# Altium schematic sheet MOTHERBOARD.SCHDOC
size 999 x 800 mm; SheetNumber: 1; SheetTotal: 1; DocumentName: Лист 1.SCHDOC
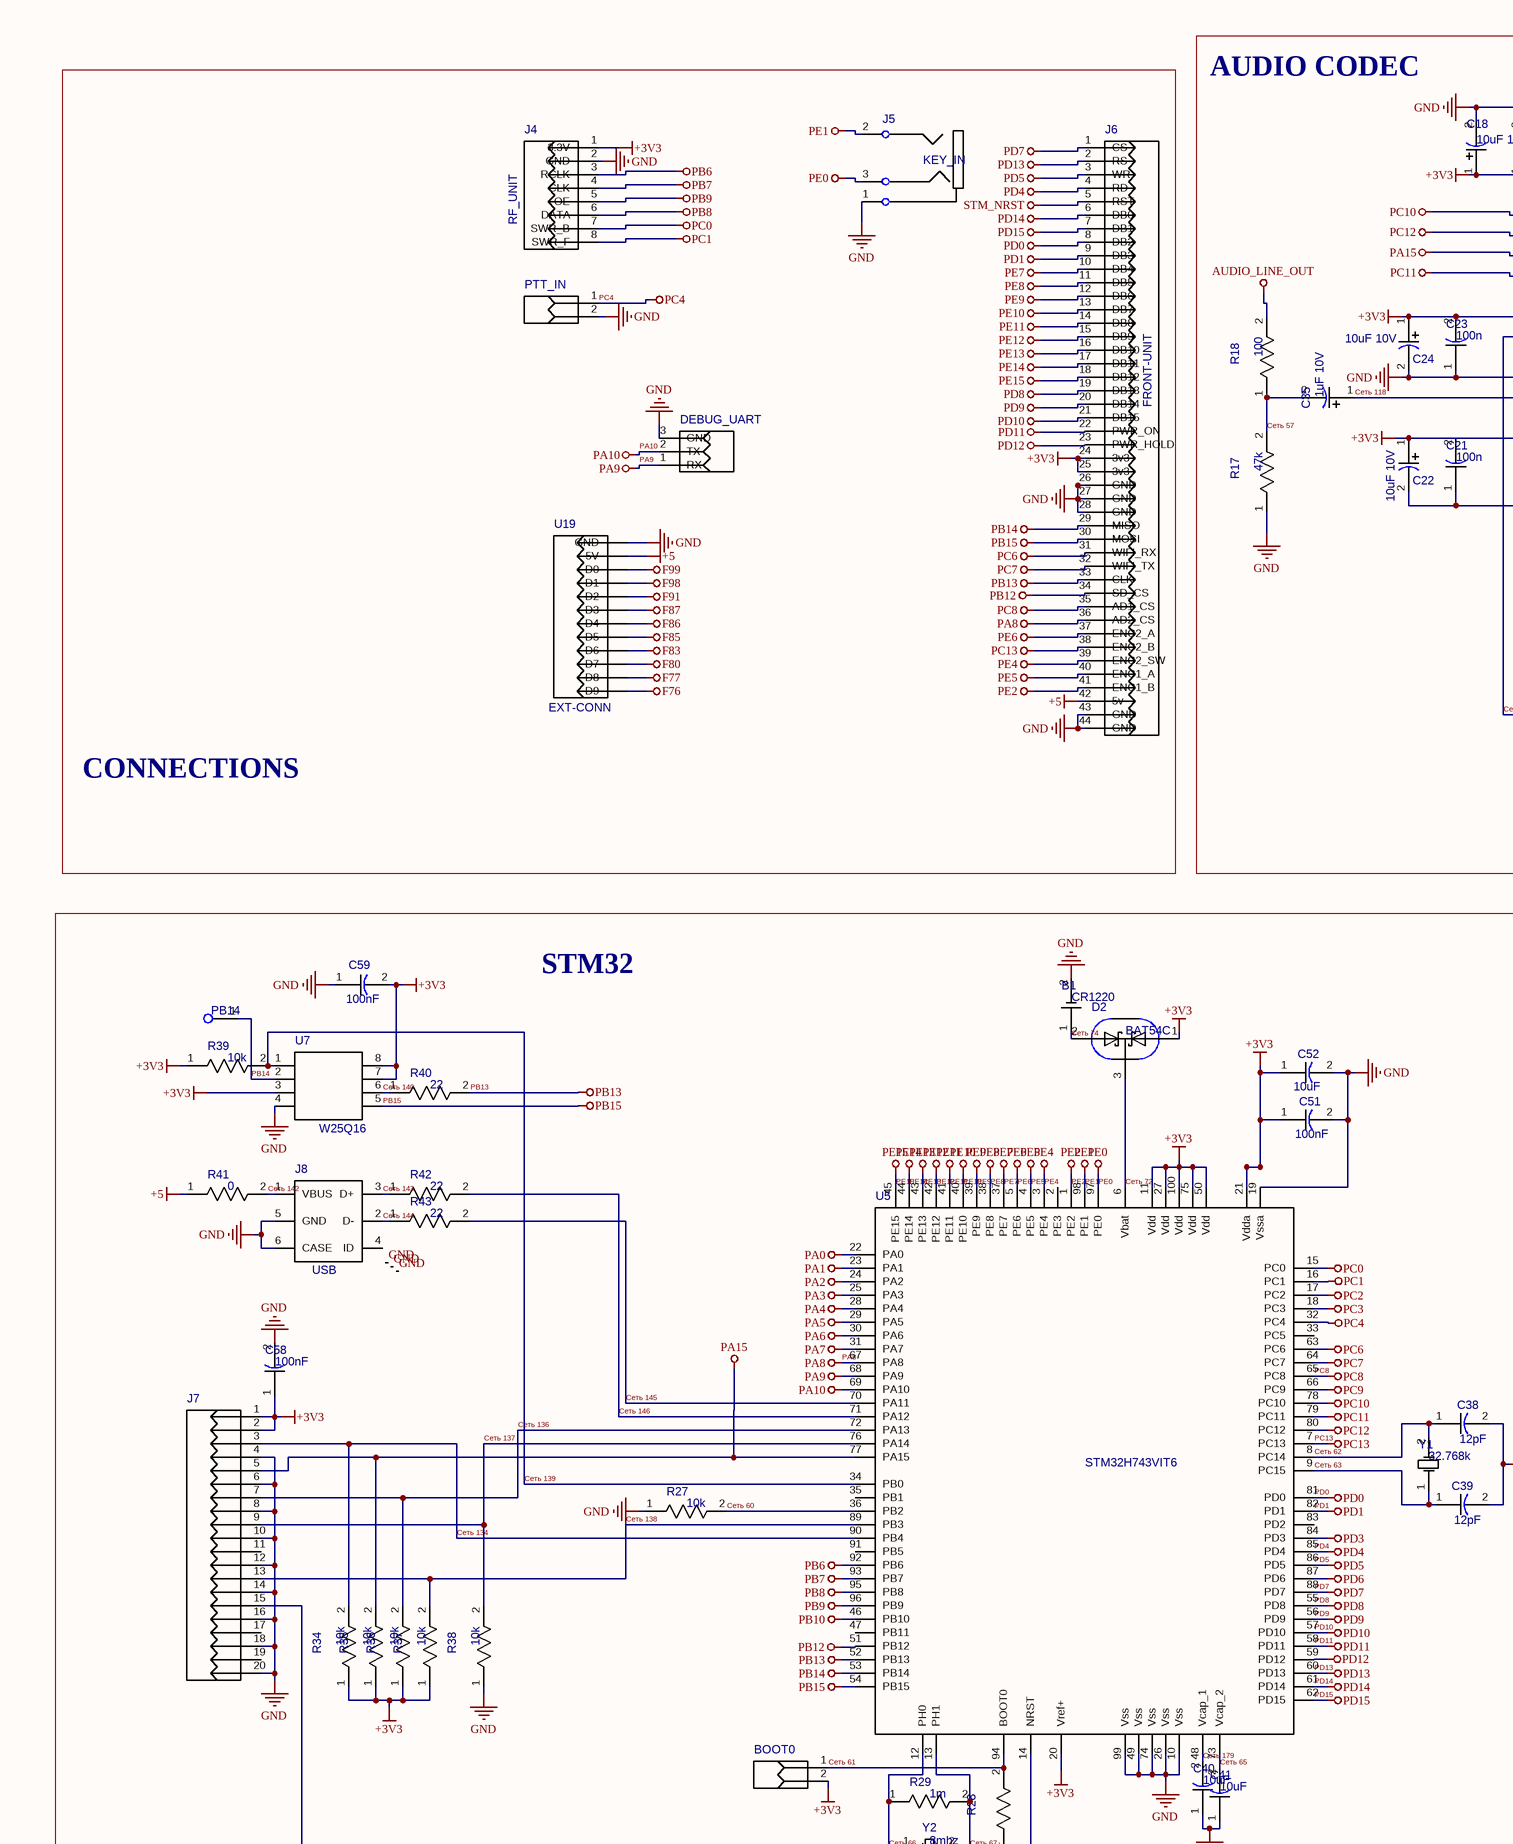
[diagram p0: MOTHERBOARD.SCHDOC, top left]
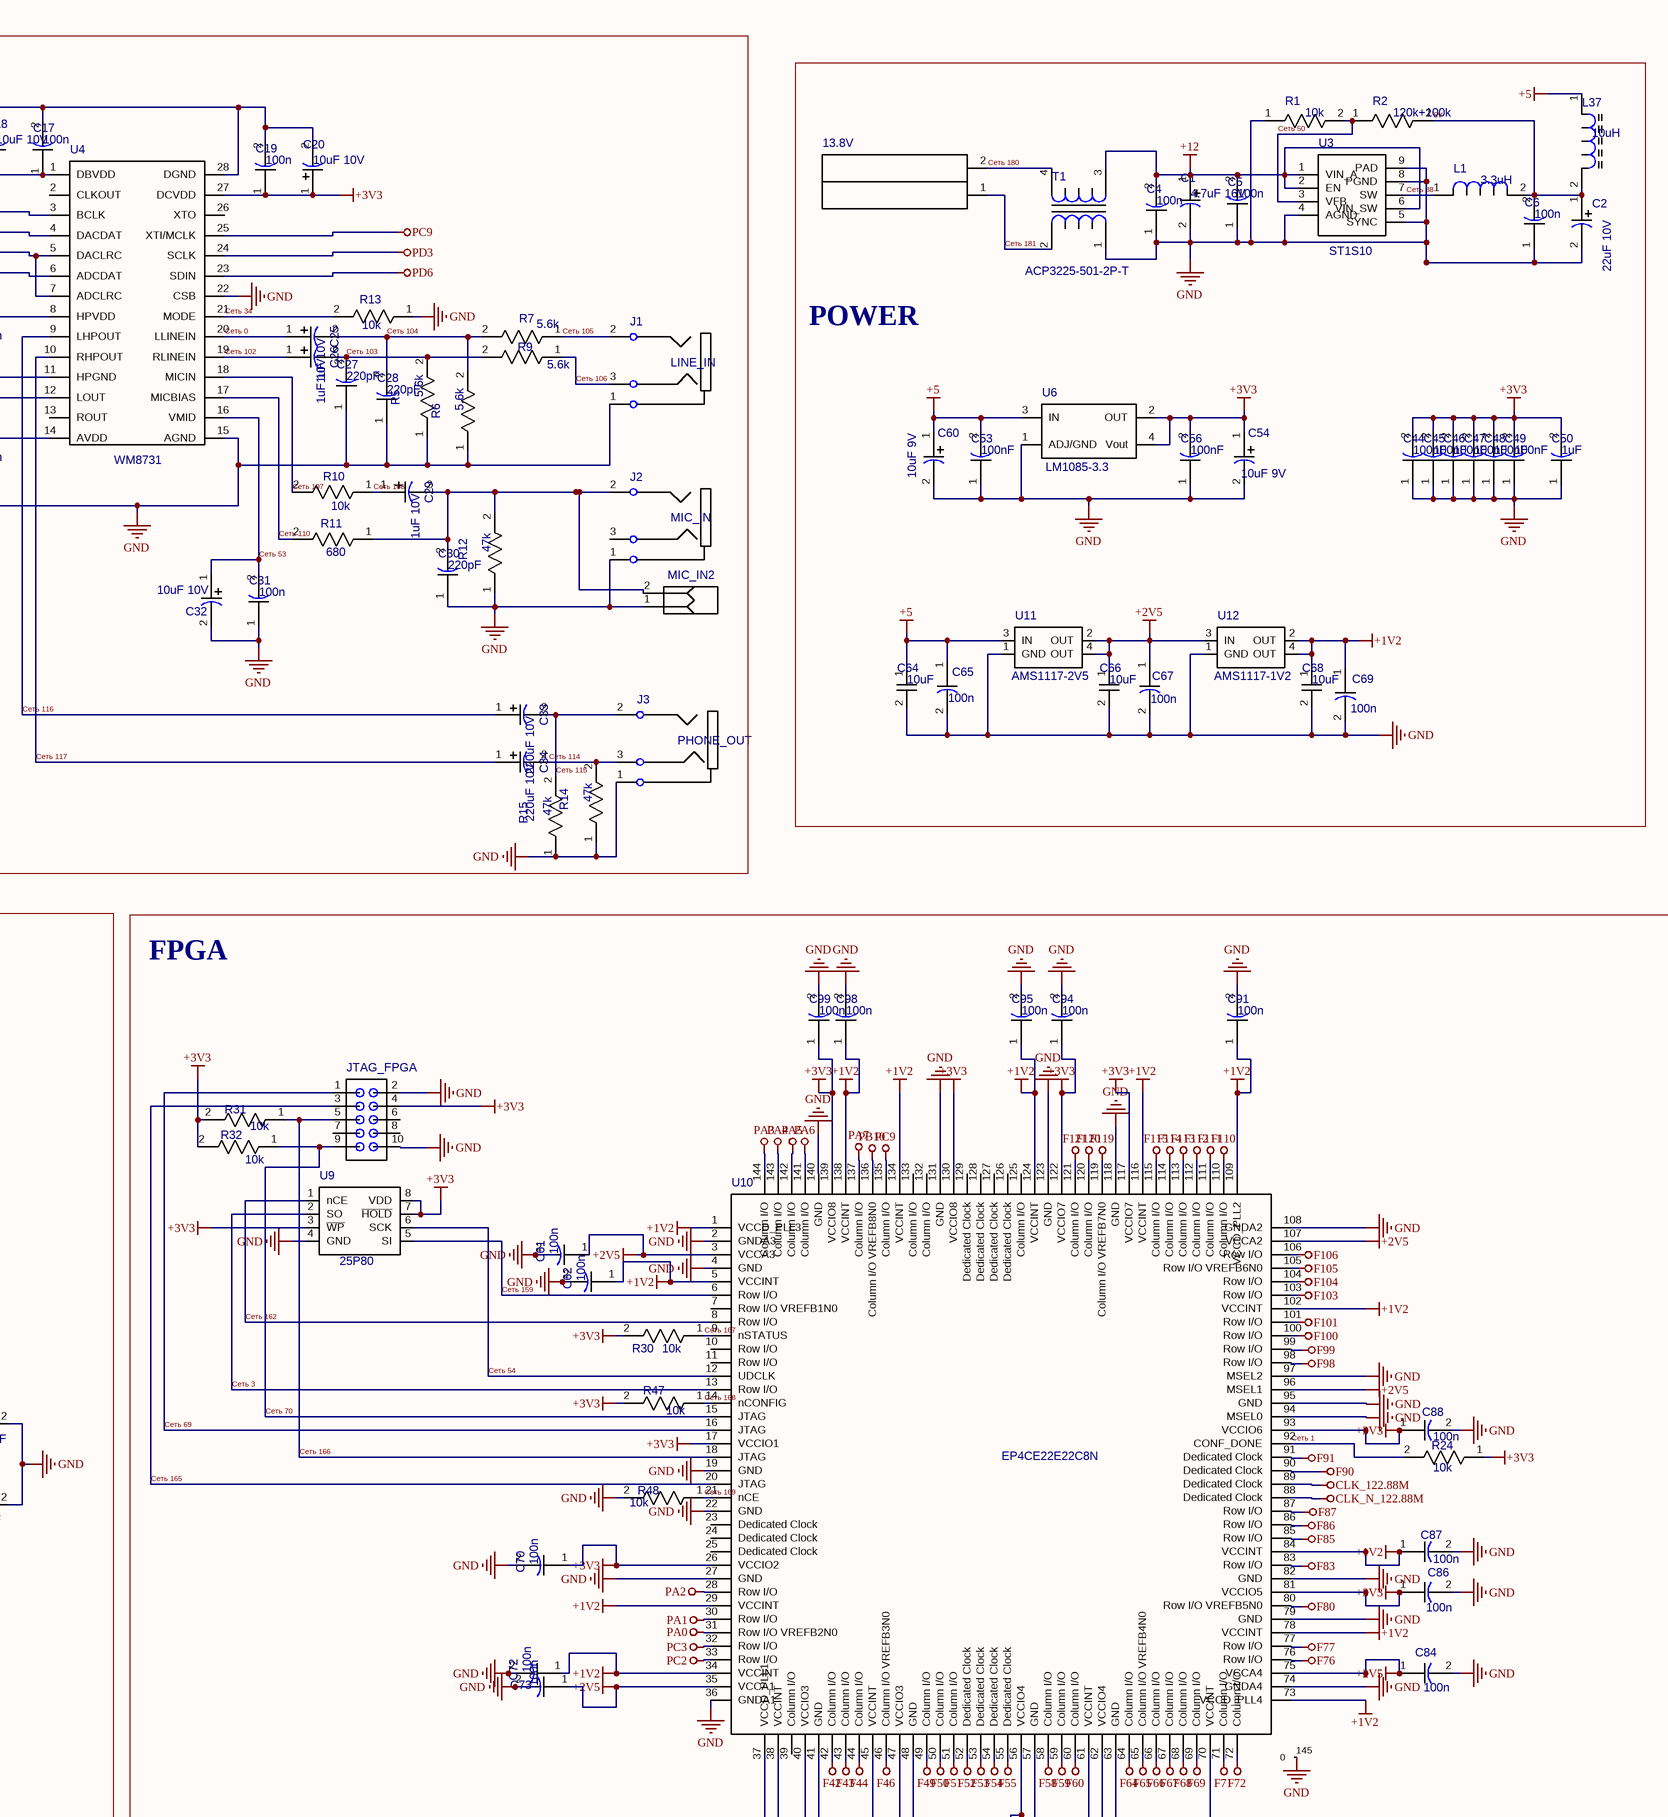
[diagram p1: MOTHERBOARD.SCHDOC, top middle]
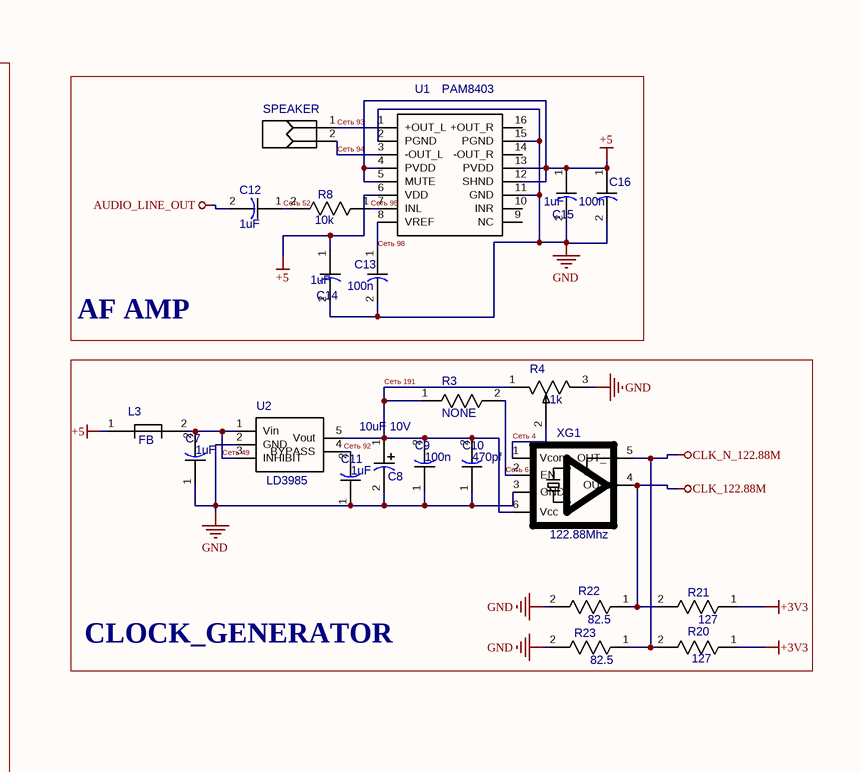
[diagram p2: MOTHERBOARD.SCHDOC, top right]
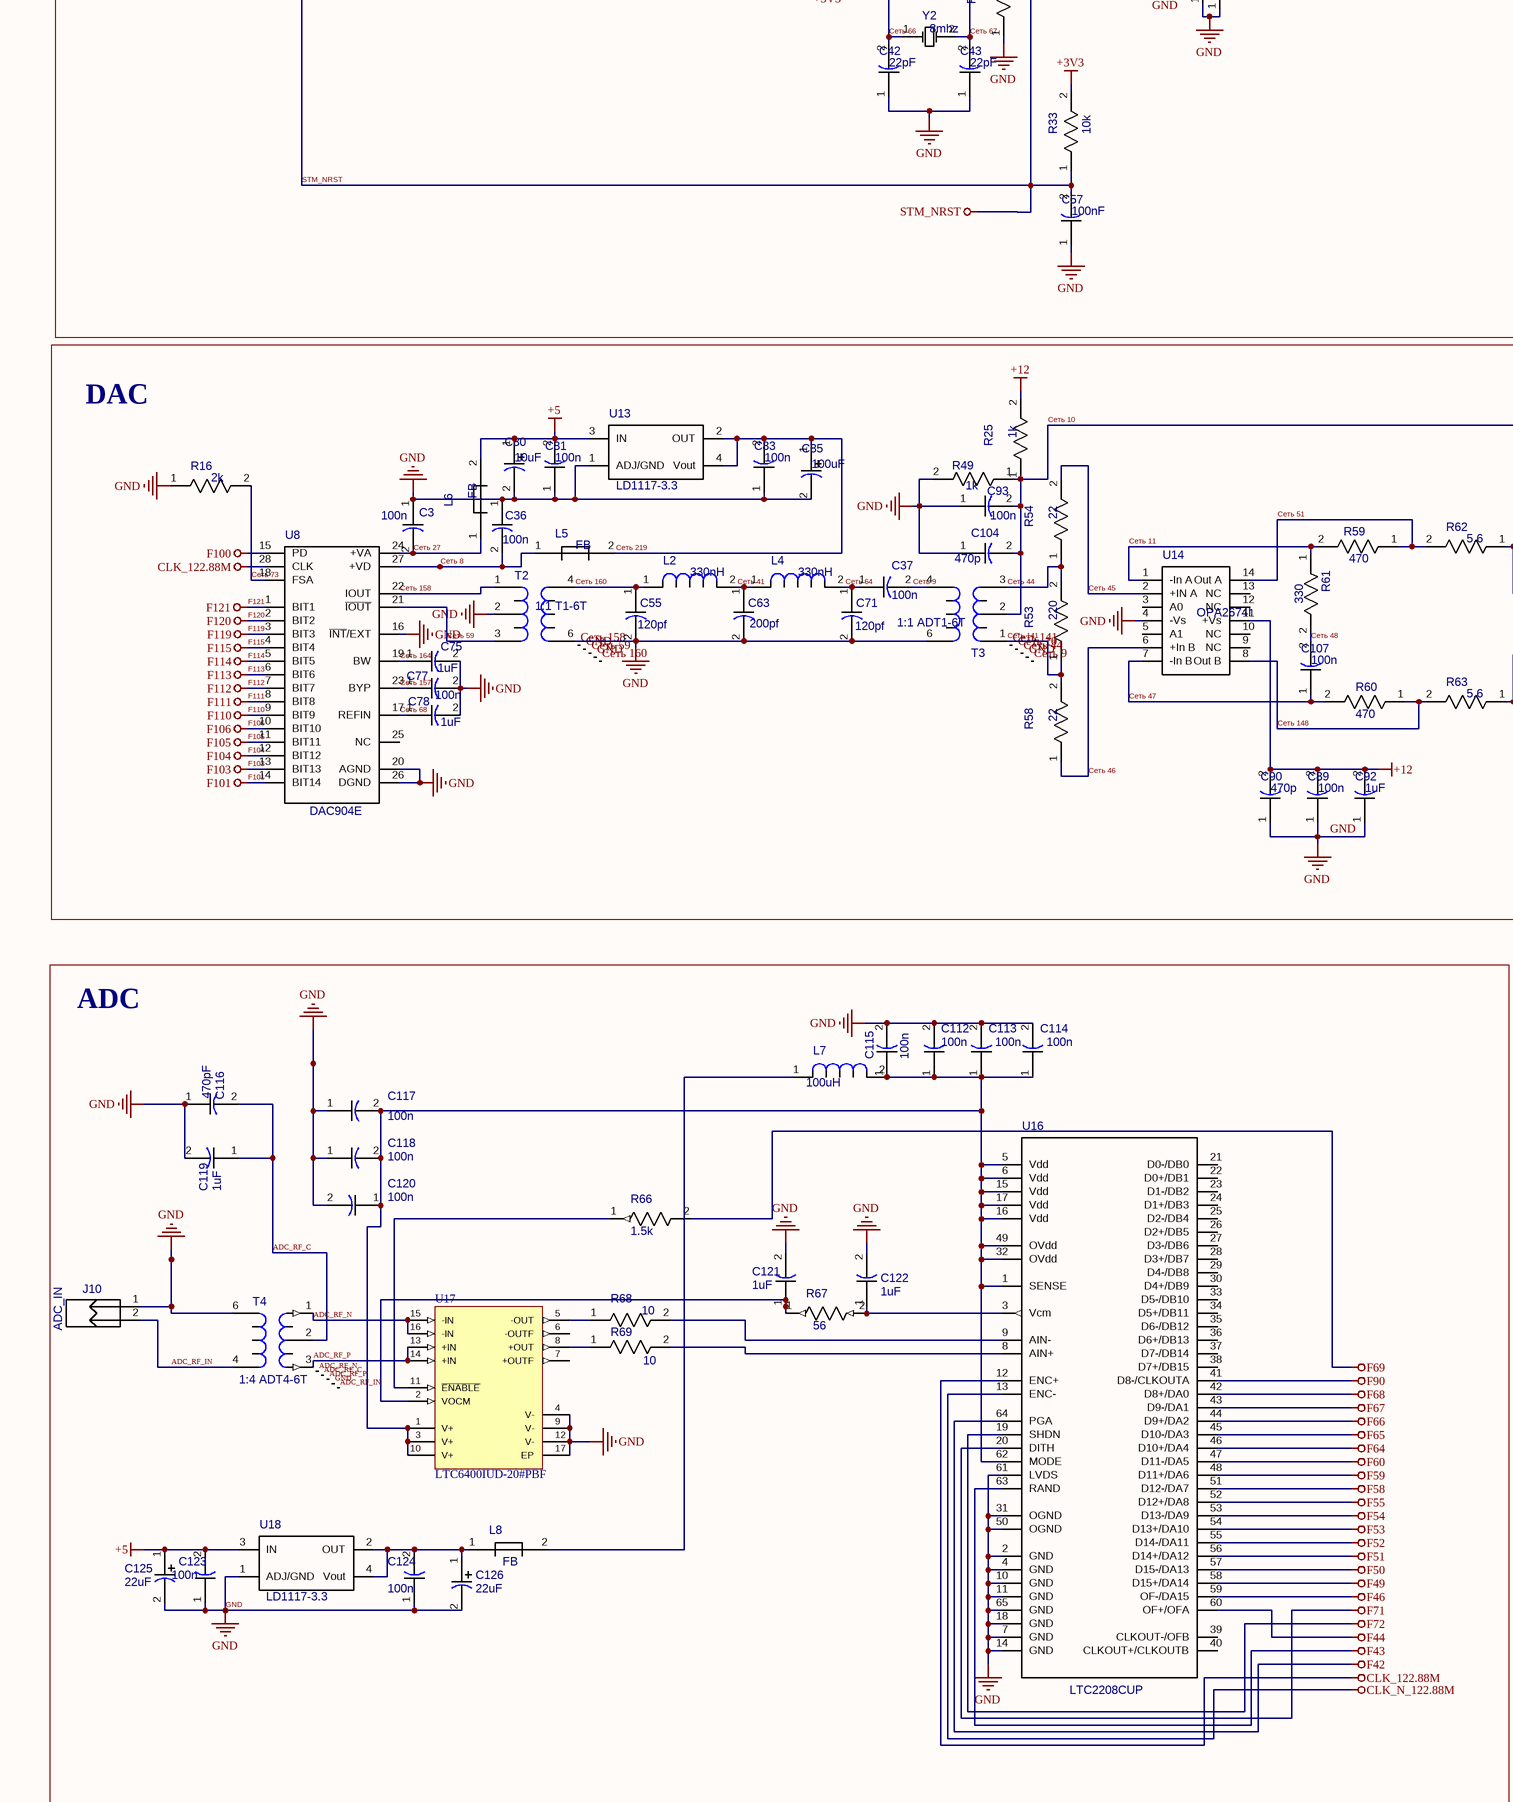
[diagram p3: MOTHERBOARD.SCHDOC, bottom left]
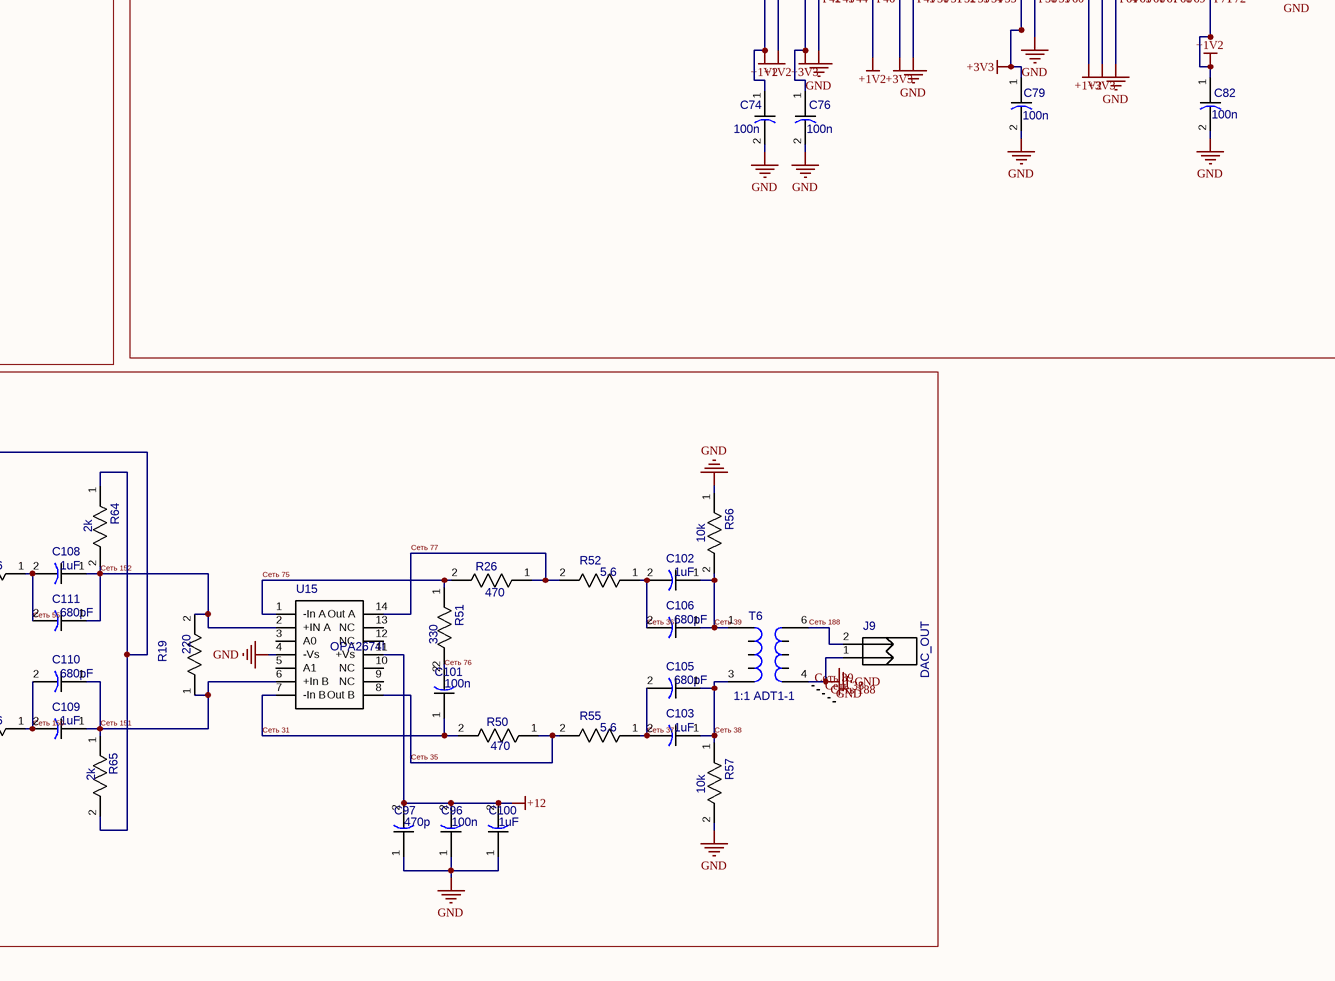
[diagram p4: MOTHERBOARD.SCHDOC, bottom middle]

## Parts
13.8V  (no value)  [JX2]
B1  CR1220  [BR1632A/FA]
BOOT0  (no value)  [51022-0200]
C1  4.7uF 16V  [CAPAE_6.6x6.6h5.4]
C2  22uF 10V  [CAPAE_4.3x4.3h5.4]
C3  100n  [CAP_0805]
C4  100n  [CAP_0805]
C5  100n  [CAP_0805]
C6  100n  [CAP_0805]
C7  1uF  [CAP_0805]
C8  10uF 10V  [CAPAE_4.3x4.3h5.4]
C9  100n  [CAP_0805]
C10  470pf  [CAP_0805]
C11  1uF  [CAP_0805]
C12  1uF  [CAP_0805]
C13  100n  [CAP_0805]
C14  1uF  [CAP_0805]
C15  1uF  [CAP_0805]
C16  100n  [CAP_0805]
C17  100n  [CAP_0805]
C18  10uF 10V  [CAPAE_4.3x4.3h5.4]
C19  100n  [CAP_0805]
C20  10uF 10V  [CAPAE_4.3x4.3h5.4]
C21  100n  [CAP_0805]
C22  10uF 10V  [CAPAE_4.3x4.3h5.4]
C23  100n  [CAP_0805]
C24  10uF 10V  [CAPAE_4.3x4.3h5.4]
C25  1uF 10V  [CAPAE_4.3x4.3h5.4]
C26  1uF 10V  [CAPAE_4.3x4.3h5.4]
C27  220pF  [CAP_0805]
C28  220pF  [CAP_0805]
C29  1uF 10V  [CAPAE_4.3x4.3h5.4]
C30  220pF  [CAP_0805]
C31  100n  [CAP_0805]
C32  10uF 10V  [CAPAE_4.3x4.3h5.4]
C33  220uF 10V  [CAPAE_4.3x4.3h5.4]
C34  220uF 10V  [CAPAE_4.3x4.3h5.4]
C35  1uF 10V  [CAPAE_4.3x4.3h5.4]
C36  100n  [CAP_0805]
C37  100n  [CAP_0805]
C38  12pF  [CAP_0805]
C39  12pF  [CAP_0805]
C40  10uF  [CAP_0805]
C41  10uF  [CAP_0805]
C42  22pF  [CAP_0805]
C43  22pF  [CAP_0805]
C44  100nF  [CAP_0805]
C45  100nF  [CAP_0805]
C46  100nF  [CAP_0805]
C47  100nF  [CAP_0805]
C48  100nF  [CAP_0805]
C49  100nF  [CAP_0805]
C50  value 1uF  [CAP_0805]  (hidden comment: 10uF)
C51  100nF  [CAP_0805]
C52  10uF  [CAP_0805]
C53  100nF  [CAP_0805]
C54  10uF 9V  [CAPAE_4.3x4.3h5.4]
C55  120pf  [CAP_0805]
C56  100nF  [CAP_0805]
C57  100nF  [CAP_0805]
C58  100nF  [CAP_0805]
C59  100nF  [CAP_0805]
C60  10uF 9V  [CAPAE_4.3x4.3h5.4]
C61  100n  [CAP_0805]
C62  100n  [CAP_0805]
C63  200pf  [CAP_0805]
C64  10uF  [C0805]
C65  100n  [CAP_0805]
C66  10uF  [C0805]
C67  100n  [CAP_0805]
C68  10uF  [C0805]
C69  100n  [CAP_0805]
C70  100n  [CAP_0805]
C71  120pf  [CAP_0805]
C72  100n  [CAP_0805]
C73  100n  [CAP_0805]
C74  100n  [CAP_0805]
C75  1uF  [CAP_0805]
C76  100n  [CAP_0805]
C77  100n  [CAP_0805]
C78  1uF  [CAP_0805]
C79  100n  [CAP_0805]
C80  10uF  [EEEFC_sizeB]
C81  100n  [CAP_0805]
C82  100n  [CAP_0805]
C83  100n  [CAP_0805]
C84  100n  [CAP_0805]
C85  100uF  [EEEFC_sizeB]
C86  100n  [CAP_0805]
C87  100n  [CAP_0805]
C88  100n  [CAP_0805]
C89  100n  [CAP_0805]
C90  470p  [CAP_0805]
C91  100n  [CAP_0805]
C92  1uF  [CAP_0805]
C93  100n  [CAP_0805]
C94  100n  [CAP_0805]
C95  100n  [CAP_0805]
C96  100n  [CAP_0805]
C97  470p  [CAP_0805]
C98  100n  [CAP_0805]
C99  100n  [CAP_0805]
C100  1uF  [CAP_0805]
C101  100n  [CAP_0805]
C102  1uF  [CAP_1206]
C103  1uF  [CAP_1206]
C104  470p  [CAP_0805]
C105  680pF  [CAP_1206]
C106  680pF  [CAP_1206]
C107  100n  [CAP_0805]
C108  1uF  [CAP_1206]
C109  1uF  [CAP_1206]
C110  680pF  [CAP_1206]
C111  680pF  [CAP_1206]
C112  value 100n  [CAP_0805]  (hidden comment: CAP_0805)
C113  value 100n  [CAP_0805]  (hidden comment: CAP_0805)
C114  value 100n  [CAP_0805]  (hidden comment: CAP_0805)
C115  value 100n  [CAP_0805]  (hidden comment: CAP_0805)
C116  value 470pF  [CAP_0805]  (hidden comment: CAP_0805)
C117  value 100n  [CAP_0805]  (hidden comment: CAP_0805)
C118  value 100n  [CAP_0805]  (hidden comment: CAP_0805)
C119  value 1uF  [CAP_0805]  (hidden comment: CAP_0805)
C120  value 100n  [CAP_0805]  (hidden comment: CAP_0805)
C121  value 1uF  [CAP_0805]  (hidden comment: CAP_0805)
C122  value 1uF  [CAP_0805]  (hidden comment: CAP_0805)
C123  100n  [CAP_0805]
C124  value 100n  [CAP_0805]  (hidden comment: CAP_0805)
C125  22uF  [TC3528-1411]
C126  value 22uF  [TC3528-1411]  (hidden comment: EEEFC_sizeB)
D2  BAT54C  [BAT54C]
DEBUG_UART  (no value)  [51022-0300]
J1  LINE_IN  [SJ1-3523N]
J2  MIC_IN  [SJ1-3523N]
J3  PHONE_OUT  [SJ1-3523N]
J4  RF_UNIT  [90131-0124]
J5  KEY_IN  [SJ1-3523N]
J6  FRONT-UNIT  [90131-0142]
J7  JTAG_STM32  [90131-0130]  (value not drawn)
J8  USB  [2-1734035-3]
J9  DAC_OUT  [644456-2]
J10  ADC_IN  [644456-2]
JTAG_FPGA  (no value)  [IDC10]
L1  3.3uH  [IND_1812]
L2  330nH  [IND_0805]
L3  FB  [IND_FERRITE_BEAD]
L4  330nH  [IND_0805]
L5  FB  [IND_FERRITE_BEAD]
L6  FB  [IND_FERRITE_BEAD]
L7  value 100uH  [14-1210]  (hidden comment: IND_1206)
L8  value FB  [RES6.5-3.4X1.9]  (hidden comment: IND_FERRITE_BEAD)
L37  10uH  [IND_FERRITE_CORE]
MIС_IN2  (no value)  [51022-0200]
NetPort96  PB14  (graphical)
PTT_IN  (no value)  [51022-0200]
R1  10k  [RES_0805]
R2  120k+100k  [RES_0805]
R3  NONE  [RES_0805]
R4  1k  [EVM1DSX30B]
R5  5.6k  [RES_0805]
R6  5.6k  [RES_0805]
R7  5.6k  [RES_0805]
R8  10k  [RES_0805]
R9  5.6k  [RES_0805]
R10  10k  [RES_0805]
R11  680  [RES_0805]
R12  47k  [RES_0805]
R13  10k  [RES_0805]
R14  47k  [RES_0805]
R15  47k  [RES_0805]
R16  2k  [RES_0805]
R17  47k  [RES_0805]
R18  100  [RES_0805]
R19  220  [RES_0805]
R20  127  [RES_0805]
R21  127  [RES_0805]
R22  82.5  [RES_0805]
R23  82.5  [RES_0805]
R24  10k  [RES_0805]
R25  1k  [RES_0805]
R26  470  [RES_0805]
R27  10k  [RES_0805]
R28  10k  [RES_0805]  (value not drawn)
R29  1m  [RES_0805]
R30  10k  [RES_0805]
R31  10k  [RES_0805]
R32  10k  [RES_0805]
R33  10k  [RES_0805]
R34  10k  [RES_0805]
R35  10k  [RES_0805]
R36  10k  [RES_0805]
R37  10k  [RES_0805]
R38  10k  [RES_0805]
R39  10k  [RES_0805]
R40  22  [RES_0805]
R41  0  [RES_0805]
R42  22  [RES_0805]
R43  22  [RES_0805]
R47  10k  [RES_0805]
R48  10k  [RES_0805]
R49  1k  [RES_0805]
R50  470  [RES_0805]
R51  330  [RES_0805]
R52  5.6  [RES_1206]
R53  220  [RES_0805]
R54  22  [RES_0805]
R55  5.6  [RES_1206]
R56  10k  [RES_0805]
R57  10k  [RES_0805]
R58  22  [RES_0805]
R59  470  [RES_0805]
R60  470  [RES_0805]
R61  330  [RES_0805]
R62  5.6  [RES_1206]
R63  5.6  [RES_1206]
R64  2k  [RES_0805]
R65  2k  [RES_0805]
R66  value 1.5k  [RES_0805]  (hidden comment: RES_0805)
R67  value 56  [RES_0805]  (hidden comment: RES_0805)
R68  value 10  [RES_0603]  (hidden comment: RES_0603)
R69  value 10  [RES_0603]  (hidden comment: RES_0603)
SPEAKER  (no value)  [51022-0200]
T1  ACP3225-501-2P-T  [TRANSF_ICORE]
T2  1:1 T1-6T  [TRANSF_ACORE2]
T3  1:1 ADT1-6T  [TRANSF_ACORE2_1]
T4  value 1:4 ADT4-6T  [TRANSF_ACORE2]  (hidden comment: TRANSF_ACORE2)
T6  1:1 ADT1-1  [TRANSF_ACORE]
U1  PAM8403  [PAM8403]
U2  LD3985  [LD3985]
U3  ST1S10  [ST1S10]
U4  WM8731  [WM8731]
U5  STM32H743VIT6  [STM32H743VIT6]
U6  LM1085-3.3  [LM1085-3.3]
U7  W25Q16  [W25Q16]
U8  DAC904E  [DAC904E]
U9  25P80  [25P80]
U10  EP4CE22E22C8N  [EP4CE22E22C8N]
U11  value AMS1117-2V5  [AMS1117]  (hidden comment: 2V5)
U12  value AMS1117-1V2  [AMS1117]  (hidden comment: 1V2)
U13  LD1117-3.3  [LT1117CST-3.3]
U14  OPA2674I  [OPA2674I]
U15  OPA2674I  [OPA2674I]
U16  LTC2208CUP  [LTC2208CUP]
U17  LTC6400IUD-20#PBF  [LT-UD-16_N]
U18  LD1117-3.3  [LT1117CST-3.3]
U19  EXT-CONN  [EXT-CONN]
XG1  122.88Mhz  [NV7050SA]
Y1  32.768k  [R26-32.768]
Y2  8mhz  [ECS-200-20-1]

## Blocks framed on the sheet
AUDIO CODEC: C17-C35 J1-J3 MIС_IN2 R5-R7 R9-R15 R17 R18 U4
CONNECTIONS: DEBUG_UART J4-J6 PTT_IN U19
POWER: 13.8V C1 C2 C4-C6 C44-C50 C53 C54 C56 C60 C64-C69 L1 L37 R1 R2 T1 U3 U6 U11 U12
AF AMP: C12-C16 R8 SPEAKER U1
CLOCK_GENERATOR: C7-C11 L3 R3 R4 R20-R23 U2 XG1
STM32: B1 BOOT0 C38-C43 C51 C52 C57-C59 D2 J7 J8 NetPort96 R27-R29 R33-R43 U5 U7 Y1 Y2
FPGA: C61 C62 C70 C72-C74 C76 C79 C82 C84 C86-C88 C91 C94 C95 C98 C99 JTAG_FPGA R24 R30-R32 R47 R48 U9 U10
DAC: C3 C36 C37 C55 C63 C71 C75 C77 C78 C80 C81 C83 C85 C89 C90 C92 C93 C96 C97 C100-C111 J9 L2 L4-L6 R16 R19 R25 R26 R49-R65 T2 T3 T6 U8 U13-U15
ADC: C112-C126 J10 L7 L8 R66-R69 T4 U16-U18

## Nets
+1V2: C62.1 C68.1 C69.1 C72.1 C74.1 C82.1 C87.1 C91.1 C95.1 C98.1 U10.1(VCCD_PLL3) U10.5(VCCINT) U10.29(VCCINT) U10.34(VCCINT) U10.37(VCCD_PLL1) U10.38(VCCINT) U10.45(VCCINT) U10.61(VCCINT) U10.70(VCCINT) U10.73(VCCD_PLL4) U10.78(VCCINT) U10.84(VCCINT) U10.102(VCCINT) U10.109(VCCD_PLL2) U10.116(VCCINT) U10.124(VCCINT) U10.134(VCCINT) U10.138(VCCINT) U12.2(OUT) U12.4(OUT)
+2V5: C61.1 C66.1 C67.1 C73.1 C84.1 U10.3(VCCA3) U10.35(VCCA1) U10.75(VCCA4) U10.96(MSEL1) U10.107(VCCA2) U11.2(OUT) U11.4(OUT) U12.3(IN)
+3V3: BOOT0.2 C17.1 C18.1(PLUS) C19.1 C20.1(PLUS) C21.2 C22.1(PLUS) C23.2 C24.1(PLUS) C44.2 C45.2 C46.2 C47.2 C48.2 C49.2 C50.2 C51.1 C52.1 C54.1(PLUS) C56.2 C58.1 C59.2 C70.1 C76.1 C79.1 C86.1 C88.1 C94.1 C99.1 D2.1((A1)) J4.1(3.3V) J6.24(3v3) J6.25(3v3) J7.1(P1) J7.2(P2) JTAG_FPGA.4 R20.1 R21.1 R24.1 R30.2 R31.2 R32.2 R33.2 R34.1 R35.1 R36.1 R37.1 R39.1 R47.2 U4.1(DBVDD) U4.8(HPVDD) U4.14(AVDD) U4.27(DCVDD) U5.11(Vdd) U5.20(Vref+) U5.21(Vdda) U5.27(Vdd) U5.50(Vdd) U5.75(Vdd) U5.100(Vdd) U6.2(OUT) U6.4(Vout) U7.3(WP) U7.7(HOLD) U7.8(VCC) U9.3(~{WP}) U9.7(~{HOLD}) U9.8(VDD) U10.17(VCCIO1) U10.26(VCCIO2) U10.40(VCCIO3) U10.47(VCCIO3) U10.56(VCCIO4) U10.62(VCCIO4) U10.81(VCCIO5) U10.93(VCCIO6) U10.117(VCCIO7) U10.122(VCCIO7) U10.130(VCCIO8) U10.139(VCCIO8)
+5: C14.1 C15.1 C16.1 C53.2 C60.1(PLUS) C64.1 C65.1 C80.1(PLUS) C81.2 C123.2 C125.1(PLUS) J6.42(5v) L3.1 L6.2 L37.1(A) R41.1 U1.4(PVDD) U1.5(MUTE) U1.6(VDD) U1.12(SHND) U1.13(PVDD) U6.3(IN) U11.3(IN) U13.3(IN) U18.3(IN) U19.2(5V)
+12: C1.1(PLUS) C4.2 C5.2 C89.2 C90.2 C92.2 C96.2 C97.2 C100.2 R25.2 T1.3(P1) U3.1(VIN_A) U3.2(EN) U3.6(VIN_SW) U14.11(+Vs) U15.11(+Vs)
AUDIO_LINE_OUT: C12.2 R18.2
CLK_122.88M: R21.2 R22.1 U8.28(CLK) U10.89(Dedicated_Clock) U16.12(ENC+) XG1.4(OUT)
CLK_N_122.88M: R20.2 R23.1 U10.88(Dedicated_Clock) U16.13(ENC-) XG1.5(OUT_)
F42: U10.42(Column_I/O) U16.64(PGA)
F43: U10.43(Column_I/O) U16.63(RAND)
F44: U10.44(Column_I/O) U16.60(OF+/OFA)
F46: U10.46(Column_I/O_VREFB3N0) U16.59(OF-/DA15)
F49: U10.49(Column_I/O) U16.58(D15+/DA14)
F50: U10.50(Column_I/O) U16.57(D15-/DA13)
F51: U10.51(Column_I/O) U16.56(D14+/DA12)
F52: U10.52(Dedicated_Clock) U16.55(D14-/DA11)
F53: U10.53(Dedicated_Clock) U16.54(D13+/DA10)
F54: U10.54(Dedicated_Clock) U16.53(D13-/DA9)
F55: U10.55(Dedicated_Clock) U16.52(D12+/DA8)
F58: U10.58(Column_I/O) U16.51(D12-/DA7)
F59: U10.59(Column_I/O) U16.48(D11+/DA6)
F60: U10.60(Column_I/O) U16.47(D11-/DA5)
F64: U10.64(Column_I/O) U16.46(D10+/DA4)
F65: U10.65(Column_I/O_VREFB4N0) U16.45(D10-/DA3)
F66: U10.66(Column_I/O) U16.44(D9+/DA2)
F67: U10.67(Column_I/O) U16.43(D9-/DA1)
F68: U10.68(Column_I/O) U16.42(D8+/DA0)
F69: R66.2 U10.69(Column_I/O)
F71: U10.71(Column_I/O) U16.20(DITH)
F72: U10.72(Column_I/O) U16.19(SHDN)
F76: U10.76(Row_I/O) U19.12(D9)
F77: U10.77(Row_I/O) U19.11(D8)
F80: U10.80(Row_I/O_VREFB5N0) U19.10(D7)
F83: U10.83(Row_I/O) U19.9(D6)
F85: U10.85(Row_I/O) U19.8(D5)
F86: U10.86(Row_I/O) U19.7(D4)
F87: U10.87(Row_I/O) U19.6(D3)
F90: U10.90(Dedicated_Clock) U16.41(D8-/CLKOUTA)
F91: U10.91(Dedicated_Clock) U19.5(D2)
F98: U10.98(Row_I/O) U19.4(D1)
F99: U10.99(Row_I/O) U19.3(D0)
F100: U8.15(PD) U10.100(Row_I/O)
F101: U8.14(BIT14) U10.101(Row_I/O)
F103: U8.13(BIT13) U10.103(Row_I/O)
F104: U8.12(BIT12) U10.104(Row_I/O)
F105: U8.11(BIT11) U10.105(Row_I/O_VREFB6N0)
F106: U8.10(BIT10) U10.106(Row_I/O)
F110: U8.9(BIT9) U10.110(Column_I/O)
F111: U8.8(BIT8) U10.111(Column_I/O)
F112: U8.7(BIT7) U10.112(Column_I/O)
F113: U8.6(BIT6) U10.113(Column_I/O)
F114: U8.5(BIT5) U10.114(Column_I/O)
F115: U8.4(BIT4) U10.115(Column_I/O)
F119: U8.3(BIT3) U10.119(Column_I/O_VREFB7N0)
F120: U8.2(BIT2) U10.120(Column_I/O)
F121: U8.1(BIT1) U10.121(Column_I/O)
GND: B1.2(NEG) C1.2(MINUS) C2.2(MINUS) C3.1 C4.1 C5.1 C6.1 C7.1 C8.2(MINUS) C9.1 C10.1 C11.1 C13.2 C14.2 C15.2 C16.2 C17.2 C18.2(MINUS) C19.2 C20.2(MINUS) C21.1 C22.2(MINUS) C23.1 C24.2(MINUS) C27.1 C28.1 C30.1 C31.1 C32.2(MINUS) C36.1 C38.2 C39.2 C40.1 C41.1 C42.1 C43.1 C44.1 C45.1 C46.1 C47.1 C48.1 C49.1 C50.1 C51.2 C52.2 C53.1 C54.2(MINUS) C55.2 C56.1 C57.1 C58.2 C59.1 C60.2(MINUS) C61.2 C62.2 C63.2 C64.2 C65.2 C66.2 C67.2 C68.2 C69.2 C70.2 C71.2 C72.2 C73.2 C74.2 C75.2 C76.2 C77.2 C78.2 C79.2 C80.2(MINUS) C81.1 C82.2 C83.1 C84.2 C85.2(MINUS) C86.2 C87.2 C88.2 C89.1 C90.1 C91.2 C92.1 C93.1 C94.2 C95.2 C96.1 C97.1 C98.2 C99.2 C100.1 C104.1 C112.2 C113.2 C114.2 C115.2 C116.1 C117.1 C118.1 C119.2 C120.2 C121.2 C122.2 C123.1 C124.1 C125.2(MINUS) C126.2(MINUS) DEBUG_UART.3(GND) J1.1(sleeve) J2.1(sleeve) J3.1(sleeve) J4.2(GND) J5.1(sleeve) J6.26(GND) J6.27(GND) J6.28(GND) J6.43(GND) J6.44(GND) J7.4(P4) J7.6(P6) J7.8(P8) J7.10(P10) J7.12(P12) J7.14(P14) J7.16(P16) J7.18(P18) J7.20(P20) J8.5(GND) J8.6(CASE) J8.7 J8.8 J8.9 J9.1(P1) J10.1(P1) JTAG_FPGA.2 JTAG_FPGA.10 MIС_IN2.1 PTT_IN.2 R1.1 R4.3 R5.1 R6.1 R12.1 R13.1 R14.1 R15.1 R16.1 R17.1 R22.2 R23.2 R27.1 R28.1 R38.1 R48.2 R49.2 R56.1 R57.2 T1.1(S1) T2.2(S2) T2.6(P1) T2.8 T2.10 T3.6(P2) T3.10 T4.6(P1) T4.10 T6.4(S2) T6.11 U1.2(PGND) U1.11(GND) U1.15(PGND) U2.2(GND) U3.4(AGND) U3.5(SYNC) U3.8(PGND) U3.9(PAD) U4.11(HPGND) U4.15(AGND) U4.22(CSB) U4.28(DGND) U5.10(Vss) U5.19(Vssa) U5.26(Vss) U5.49(Vss) U5.74(Vss) U5.99(Vss) U6.1(ADJ/GND) U7.4(GND) U8.16(~{INT}/EXT) U8.20(AGND) U8.26(DGND) U9.4(GND) U10.2(GNDA3) U10.4(GND) U10.19(GND) U10.22(GND) U10.27(GND) U10.36(GNDA1) U10.41(GND) U10.48(GND) U10.57(GND) U10.63(GND) U10.74(GNDA4) U10.79(GND) U10.82(GND) U10.94(MSEL0) U10.95(GND) U10.97(MSEL2) U10.108(GNDA2) U10.118(GND) U10.123(GND) U10.131(GND) U10.140(GND) U10.145(0) U11.1(GND) U12.1(GND) U13.1(ADJ/GND) U14.4(-Vs) U15.4(-Vs) U16.2(GND) U16.4(GND) U16.7(GND) U16.10(GND) U16.11(GND) U16.14(GND) U16.18(GND) U16.31(OGND) U16.50(OGND) U16.61(LVDS) U16.65(GND) U17.4(V-) U17.9(V-) U17.12(V-) U17.17(EP) U18.1(ADJ/GND) U19.1(GND) XG1.3(GND)
PA0: U5.22(PA0) U10.31(Row_I/O_VREFB2N0)
PA1: U5.23(PA1) U10.30(Row_I/O)
PA2: U5.24(PA2) U10.28(Row_I/O)
PA3: U5.25(PA3) U10.144(Column_I/O)
PA4: U5.28(PA4) U10.143(Column_I/O)
PA5: U5.29(PA5) U10.142(Column_I/O)
PA6: U5.30(PA6) U10.141(Column_I/O)
PA7: U5.31(PA7) U10.137(Column_I/O)
PA8: J6.36(AD2_CS) U5.67(PA8)
PA9: DEBUG_UART.1(RX) U5.68(PA9)
PA10: DEBUG_UART.2(TX) U5.69(PA10)
PA15: J7.5(P5) R35.2 U4.5(DACLRC) U4.7(ADCLRC) U5.77(PA15)
PB6: J4.3(RCLK) U5.92(PB6)
PB7: J4.4(CLK) U5.93(PB7)
PB8: J4.6(DATA) U5.95(PB8)
PB9: J4.5(OE) U5.96(PB9)
PB10: U5.46(PB10) U10.136(Column_I/O_VREFB8N0)
PB12: J6.34(SD_CS) U5.51(PB12)
PB13: J6.33(CLK) R40.2 U5.52(PB13)
PB14: J6.29(MISO) NetPort96.1 U5.53(PB14) U7.2(SO)
PB15: J6.30(MOSI) U5.54(PB15) U7.5(SI)
PC0: J4.7(SWR_B) U5.15(PC0)
PC1: J4.8(SWR_F) U5.16(PC1)
PC2: U5.17(PC2) U10.33(Row_I/O)
PC3: U5.18(PC3) U10.32(Row_I/O)
PC4: PTT_IN.1 U5.32(PC4)
PC6: J6.31(WIFI_RX) U5.63(PC6)
PC7: J6.32(WIFI_TX) U5.64(PC7)
PC8: J6.35(AD1_CS) U5.65(PC8)
PC9: U4.25(XTI/MCLK) U5.66(PC9) U10.135(Column_I/O)
PC10: U4.3(BCLK) U5.78(PC10)
PC11: U4.6(ADCDAT) U5.79(PC11)
PC12: U4.4(DACDAT) U5.80(PC12)
PC13: J6.38(ENC2_B) U5.7(PC13)
PD0: J6.8(DB2) U5.81(PD0)
PD1: J6.9(DB3) U5.82(PD1)
PD3: U4.24(SCLK) U5.84(PD3)
PD4: J6.4(RD) U5.85(PD4)
PD5: J6.3(WR) U5.86(PD5)
PD6: U4.23(SDIN) U5.87(PD6)
PD7: J6.1(CS) U5.88(PD7)
PD8: J6.19(DB13) U5.55(PD8)
PD9: J6.20(DB14) U5.56(PD9)
PD10: J6.21(DB15) U5.57(PD10)
PD11: J6.22(PWR_ON) U5.58(PD11)
PD12: J6.23(PWR_HOLD) U5.59(PD12)
PD13: J6.2(RS) U5.60(PD13)
PD14: J6.6(DB0) U5.61(PD14)
PD15: J6.7(DB1) U5.62(PD15)
PE0: J5.3(ring) U5.97(PE0)
PE1: J5.2(tip) U5.98(PE1)
PE2: J6.41(ENC1_B) U5.1(PE2)
PE4: J6.39(ENC2_SW) U5.3(PE4)
PE5: J6.40(ENC1_A) U5.4(PE5)
PE6: J6.37(ENC2_A) U5.5(PE6)
PE7: J6.10(DB4) U5.37(PE7)
PE8: J6.11(DB5) U5.38(PE8)
PE9: J6.12(DB6) U5.39(PE9)
PE10: J6.13(DB7) U5.40(PE10)
PE11: J6.14(DB8) U5.41(PE11)
PE12: J6.15(DB9) U5.42(PE12)
PE13: J6.16(DB10) U5.43(PE13)
PE14: J6.17(DB11) U5.44(PE14)
PE15: J6.18(DB12) U5.45(PE15)
STM_NRST: C57.2 J6.5(RST) J7.15(P15) R33.1 U5.14(NRST)
5V: C2.1(PLUS) C6.2 L1.2 L37.2(B) R2.2
ADC_RF_C: C116.2 C119.1 T4.2(S2) T4.8
ADC_RF_IN: J10.2(P2) T4.4(P2) T4.11
ADC_RF_N: T4.1(S1) T4.7 U17.15(-IN) U17.16(-IN)
ADC_RF_P: T4.3(S3) T4.9 U17.13(+IN) U17.14(+IN)
Сеть 0: C25.1(PLUS) U4.20(LLINEIN)
Сеть 1: R24.2 U10.92(CONF_DONE)
Сеть 3: U9.2(SO) U10.13(Row_I/O)
Сеть 4: R4.2 XG1.1(Vcont)
Сеть 6: R3.2 XG1.2(EN)
Сеть 8: C36.2 L5.1 U8.27(+VD)
Сеть 9: C37.2 T3.4(P1) T3.11
Сеть 10: C93.2 C104.2 R25.1 R49.1 R64.1 R65.2 T3.2(S2) T3.8
Сеть 11: R59.2 R61.1 U14.1(-In_A)
Сеть 27: C3.2 L6.1 U8.24(+VA)
Сеть 31: C101.1 R50.2 U15.7(-In_B)
Сеть 34: R13.2 U4.21(MODE)
Сеть 35: R50.1 R55.2 U15.8(Out_B)
Сеть 36: C102.2 C106.2 R52.1
Сеть 37: C103.2 C105.2 R55.1
Сеть 38: C103.1 C105.1 R57.1 T6.3(P2) T6.9
Сеть 39: C102.1 C106.1 R56.2 T6.1(P1) T6.7
Сеть 41: C63.1 L2.2 L4.1
Сеть 44: R53.2 R54.1 T3.3(S1) T3.9
Сеть 45: R54.2 U14.2(+IN_A)
Сеть 46: R58.1 U14.6(+In_B)
Сеть 47: C107.1 R60.2 U14.7(-In_B)
Сеть 48: C107.2 R61.2
Сеть 49: C7.2 L3.2 U2.1(Vin) U2.3(INHIBIT)
Сеть 50: R1.2 R2.1 U3.3(VFB)
Сеть 51: R59.1 R62.2 U14.14(Out_A)
Сеть 52: C12.1 R8.2
Сеть 53: C31.2 C32.1(PLUS) U4.16(VMID)
Сеть 54: U9.6(SCK) U10.12(UDCLK)
Сеть 55: C108.2 C111.2 R62.1
Сеть 57: C35.2(MINUS) R17.2 R18.1
Сеть 59: T2.3(S1) T2.9 U8.21(~{IOUT})
Сеть 60: R27.2 U5.36(PB2)
Сеть 61: BOOT0.1 R28.2 U5.94(BOOT0)
Сеть 62: C38.1 U5.8(PC14) Y1.2(OSC2)
Сеть 63: C39.1 U5.9(PC15) Y1.1(OSC1)
Сеть 64: C37.1 C71.1 L4.2
Сеть 65: C41.2 U5.73(Vcap_2)
Сеть 66: C42.2 R29.1 U5.12(PH0) Y2.1(OSC1)
Сеть 67: C43.2 R29.2 U5.13(PH1) Y2.2(OSC2)
Сеть 68: C78.1 U8.17(REFIN)
Сеть 69: JTAG_FPGA.1 U10.16(JTAG)
Сеть 70: JTAG_FPGA.9 R32.1 U10.15(JTAG)
Сеть 72: D2.3((K1),(K2)) U5.6(Vbat)
Сеть 73: R16.2 U8.18(FSA)
Сеть 74: B1.1(POS) D2.2((A2))
Сеть 75: R26.2 R51.1 U15.1(-In_A)
Сеть 76: C101.2 R51.2
Сеть 77: R26.1 R52.2 U15.14(Out_A)
Сеть 88: L1.1 U3.7(SW)
Сеть 92: C11.2 U2.4(BYPASS)
Сеть 93: SPEAKER.1 U1.1(+OUT_L)
Сеть 94: SPEAKER.2 U1.3(-OUT_L)
Сеть 95: R8.1 U1.7(INL)
Сеть 98: C13.1 U1.8(VREF)
Сеть 102: C26.1(PLUS) U4.19(RLINEIN)
Сеть 103: C26.2(MINUS) C27.2 R5.2 R9.2
Сеть 104: C25.2(MINUS) C28.2 R6.2 R7.2
Сеть 105: J1.2(tip) R7.1
Сеть 106: J1.3(ring) R9.1
Сеть 107: R10.2 U4.18(MICIN)
Сеть 108: C29.1(PLUS) R10.1
Сеть 110: R11.2 U4.17(MICBIAS)
Сеть 114: C34.2(MINUS) J3.3(ring) R14.2
Сеть 115: C33.2(MINUS) J3.2(tip) R15.2
Сеть 116: C33.1(PLUS) U4.9(LHPOUT)
Сеть 117: C34.1(PLUS) U4.10(RHPOUT)
Сеть 118: C35.1(PLUS) U4.12(LOUT)
Сеть 134: J7.3(P3) R34.2 U5.90(PB4)
Сеть 136: J7.7(P7) R36.2 U5.72(PA13)
Сеть 137: J7.9(P9) R38.2 U5.76(PA14)
Сеть 138: J7.13(P13) R37.2 U5.89(PB3)
Сеть 139: R39.2 U5.34(PB0) U7.1(CS)
Сеть 140: R40.1 U7.6(CLK)
Сеть 141: R53.1 R58.2 T3.1(S3) T3.7
Сеть 142: J8.1(VBUS) R41.2
Сеть 143: J8.3(D+) R42.1
Сеть 144: J8.2(D-) R43.1
Сеть 145: R43.2 U5.70(PA11)
Сеть 146: R42.2 U5.71(PA12)
Сеть 148: R60.1 R63.2 U14.8(Out_B)
Сеть 150: C109.2 C110.2 R63.1
Сеть 151: C109.1 C110.1 R19.1 R65.1 U15.6(+In_B)
Сеть 152: C108.1 C111.1 R19.2 R64.2 U15.2(+IN_A)
Сеть 157: C77.1 U8.23(BYP)
Сеть 158: T2.1(S3) T2.7 U8.22(IOUT)
Сеть 159: U9.5(SI) U10.6(Row_I/O)
Сеть 160: C55.1 L2.1 T2.4(P2) T2.11
Сеть 162: U9.1(nCE) U10.8(Row_I/O)
Сеть 164: C75.1 U8.19(BW)
Сеть 165: JTAG_FPGA.3 U10.20(JTAG)
Сеть 166: JTAG_FPGA.5 R31.1 U10.18(JTAG)
Сеть 167: R30.1 U10.9(nSTATUS)
Сеть 168: R47.1 U10.14(nCONFIG)
Сеть 169: R48.1 U10.21(nCE)
Сеть 179: C40.2 U5.48(Vcap_1)
Сеть 180: 13.8V.2 T1.4(P2)
Сеть 181: 13.8V.1 T1.2(S2)
Сеть 188: J9.2(P2) T6.6(S1) T6.10
Сеть 191: C8.1(PLUS) C9.2 C10.2 R3.1 R4.1 U2.5(Vout) XG1.6(Vcc)
Сеть 219: C83.2 C85.1(PLUS) L5.2 U13.2(OUT) U13.4(Vout)
NetC29_2: C29.2(MINUS) C30.2 J2.2(tip) MIС_IN2.2 R11.1 R12.2
NetC112_1: C112.1 C113.1 C114.1 C115.1 C117.2 C118.2 C120.1 L7.2 U16.1(SENSE) U16.5(Vdd) U16.6(Vdd) U16.15(Vdd) U16.16(Vdd) U16.17(Vdd) U16.32(OVdd) U16.49(OVdd) U16.62(MODE) U17.1(V+) U17.3(V+) U17.10(V+)
NetC121_1: C121.1 R67.1 U17.2(VOCM)
NetC122_1: C122.1 R67.2 U16.3(Vcm)
NetC124_2: C124.2 C126.1(PLUS) L8.1 U18.2(OUT) U18.4(Vout)
NetL7_1: L7.1 L8.2
NetR66_1: R66.1 U17.11(~{ENABLE})
NetR68_1: R68.1 U17.5(-OUT)
NetR68_2: R68.2 U16.9(AIN-)
NetR69_1: R69.1 U17.8(+OUT)
NetR69_2: R69.2 U16.8(AIN+)

Not connected (* = marked no-connect by the designer): J2 3(ring); J7 11(P11) 17(P17) 19(P19); J8 4(ID); JTAG_FPGA 6 7 8; T6 8(0); U1 9(NC) 10(INR) 14(-OUT_R) 16(+OUT_R); U4 2(CLKOUT) 13(ROUT) 26(XTO); U5 2(PE3) 33(PC5) 35(PB1) 47(PB11) 83(PD2) 91(PB5); U8 25(NC); U10 7(Row_I/O_VREFB1N0) 10(Row_I/O) 11(Row_I/O) 23(Dedicated_Clock) 24(Dedicated_Clock) 25(Dedicated_Clock) 39(Column_I/O) 125(Column_I/O) 126(Dedicated_Clock) 127(Dedicated_Clock) 128(Dedicated_Clock) 129(Dedicated_Clock) 132(Column_I/O) 133(Column_I/O); U14 3(A0) 5(A1) 9(NC) 10(NC) 12(NC) 13(NC); U15 3(A0) 5(A1) 9(NC) 10(NC) 12(NC) 13(NC); U16 21(D0-/DB0) 22(D0+/DB1) 23(D1-/DB2) 24(D1+/DB3) 25(D2-/DB4) 26(D2+/DB5) 27(D3-/DB6) 28(D3+/DB7) 29(D4-/DB8) 30(D4+/DB9) 33(D5-/DB10) 34(D5+/DB11) 35(D6-/DB12) 36(D6+/DB13) 37(D7-/DB14) 38(D7+/DB15) 39(CLKOUT-/OFB) 40(CLKOUT+/CLKOUTB); U17 6(-OUTF) 7(+OUTF)

## Library data of the parts
13.8V = JX2
B1 = BR1632A/FA: Value: CR1220
BOOT0 MIС_IN2 PTT_IN SPEAKER = 51022-0200
C1 = CAPAE_6.6x6.6h5.4: Value: 4.7uF 16V
C2 C8 C18 C20 C22 C24-C26 C29 C32-C35 C54 C60 = CAPAE_4.3x4.3h5.4
  C2: Value: 22uF 10V
  C8 C18 C20 C22 C24 C32: Value: 10uF 10V
  C25 C26 C29 C35: Value: 1uF 10V
  C33 C34: Value: 220uF 10V
  C54 C60: Value: 10uF 9V
C3-C7 C9-C17 C19 C21 C23 C27 C28 C30 C31 C36-C53 C55-C59 C61-C63 C65 C67 C69-C79 C81-C84 C86-C101 C104 C107 C123 = CAP_0805
  C3-C6 C9 C13 C16 C17 C19 C21 C23 C31 C36 C37 C61 C62 C65 C67 C69 C70 C72-C74 C76 C77 C79 C81-C84 C86-C89 C91 C93-C96 C98 C99 C101 C107 C123: Value: 100n
  C7 C11 C12 C14 C15 C75 C78 C92 C100: Value: 1uF
  C10: Value: 470pf
  C27 C28 C30: Value: 220pF
  C38 C39: Value: 12pF
  C40 C41 C52: Value: 10uF
  C42 C43: Value: 22pF
  C44-C49 C51 C53 C56-C59: Value: 100nF
  C55 C71: Value: 120pf
  C63: Value: 200pf
  C90 C97 C104: Value: 470p
C64 C66 C68 = C0805: Value: 10uF
C80 C85 C125 = EEEFC_sizeB
  C80: Value: 10uF
  C85: Value: 100uF
  C125: Value: 22uF
C102 C103 C105 C106 C108-C111 = CAP_1206
  C102 C103 C108 C109: Value: 1uF
  C105 C106 C110 C111: Value: 680pF
DEBUG_UART = 51022-0300
J1-J3 J5 = SJ1-3523N
  J1: Value: LINE_IN
  J2: Value: MIC_IN
  J3: Value: PHONE_OUT
  J5: Value: KEY_IN
J4 = 90131-0124: Value: RF_UNIT
J6 = 90131-0142: Value: FRONT-UNIT
J7 = 90131-0130: Value: JTAG_STM32
J8 = 2-1734035-3: Value: USB
J9 J10 = 644456-2
  J9: Value: DAC_OUT
  J10: Value: ADC_IN
JTAG_FPGA = IDC10
L1 = IND_1812: Value: 3.3uH
L2 L4 = IND_0805: Value: 330nH
L3 L5 L6 L8 = IND_FERRITE_BEAD: Ferrite bead on conductor
  L3 L5 L6: Value: FB
L37 = IND_FERRITE_CORE: Inductor; Value: 10uH
R1-R3 R5-R43 R47-R51 R53 R54 R56-R61 R64 R65 = RES_0805
  R1 R8 R10 R13 R24 R27 R28 R30-R39 R47 R48 R56 R57: Value: 10k
  R2: Value: 120k+100k
  R3: Value: NONE
  R5-R7 R9: Value: 5.6k
  R11: Value: 680
  R12 R14 R15 R17: Value: 47k
  R16 R64 R65: Value: 2k
  R18: Value: 100
  R19 R53: Value: 220
  R20 R21: Value: 127
  R22 R23: Value: 82.5
  R25 R49: Value: 1k
  R26 R50 R59 R60: Value: 470
  R29: Value: 1m
  R40 R42 R43 R54 R58: Value: 22
  R41: Value: 0
  R51 R61: Value: 330
R4 = EVM1DSX30B: Value: 1k
R52 R55 R62 R63 = RES_1206: Value: 5.6
T1 = TRANSF_ICORE: Transformer; Value: ACP3225-501-2P-T
T2-T4 = TRANSF_ACORE2: Transformer
  T2: Value: 1:1 T1-6T
  T3: Value: 1:1 ADT1-6T
T6 = TRANSF_ACORE: Transformer; Value: 1:1 ADT1-1
U11 U12 = AMS1117
U13 U18 = LT1117CST-3.3: Value: LD1117-3.3
U17 = CMP-0359-03855-2: Single Channel, Low Noise, Low Distortion Differential ADC Driver for 300 MHz IF, 1800 MHz Typical GBW, 4500 V/us Typical SR, 2.85 to 3.5 V, 16-Pin QFN (UD-16), Industrial, Pb-Free; Manufacturer: Linear Technology; Linear Technology Part Number: LTC6400-20; Vs Min (V): 2.85; SR (V/us) Typical: 4500; Is (mA) Typical: 90; Vs Max (V): 3.5; Vos (mV) Typical: 2; GBW (MHz) Typical: 1800; Channels (#): 1; RoHS: Pb-Free; PackageReference: LT-UD-16; Type: DIFF; ComponentLink3Description: Package Specification; PackageDescription: 16-Lead Plastic QFN, Body 3.00 x 3.00 mm, Pitch 0.5 mm; ComponentLink1URL: http://www.linear.com/; Mounting Technology: Surface Mount; ComponentLink2URL: http://cds.linear.com/docs/en/datasheet/640020f.pdf; Code_JEDEC: MO-220; PartNumber: LTC6400IUD-20#PBF; ComponentLink3URL: http://cds.linear.com/docs/en/packaging/QFN_16_05-08-1691.pdf; ComponentLink2Description: Datasheet; ComponentLink1Description: Manufacturer URL; RevisionNote: URLs updated
U19 = EXT-CONN: 90131-0130; Value: EXT-CONN
XG1 = NV7050SA: Value: 122.88Mhz
Y1 = R26-32.768: Value: 32.768k
Y2 = ECS-200-20-1: Value: 8mhz
D2 = BAT54C: Value: BAT54C
U1 = PAM8403: Value: PAM8403
U2 = LD3985: Value: LD3985
U3 = ST1S10: Value: ST1S10
U4 = WM8731: Value: WM8731
U5 = STM32H743VIT6: Value: STM32H743VIT6
U6 = LM1085-3.3: Value: LM1085-3.3
U7 = W25Q16: Value: W25Q16
U8 = DAC904E: Value: DAC904E
U9 = 25P80: Value: 25P80
U10 = EP4CE22E22C8N: Value: EP4CE22E22C8N
U14 U15 = OPA2674I: Value: OPA2674I
U16 = LTC2208CUP: Value: LTC2208CUP